# EAGLE design Temperature V 1.0 (EAGLE 7.6.0)
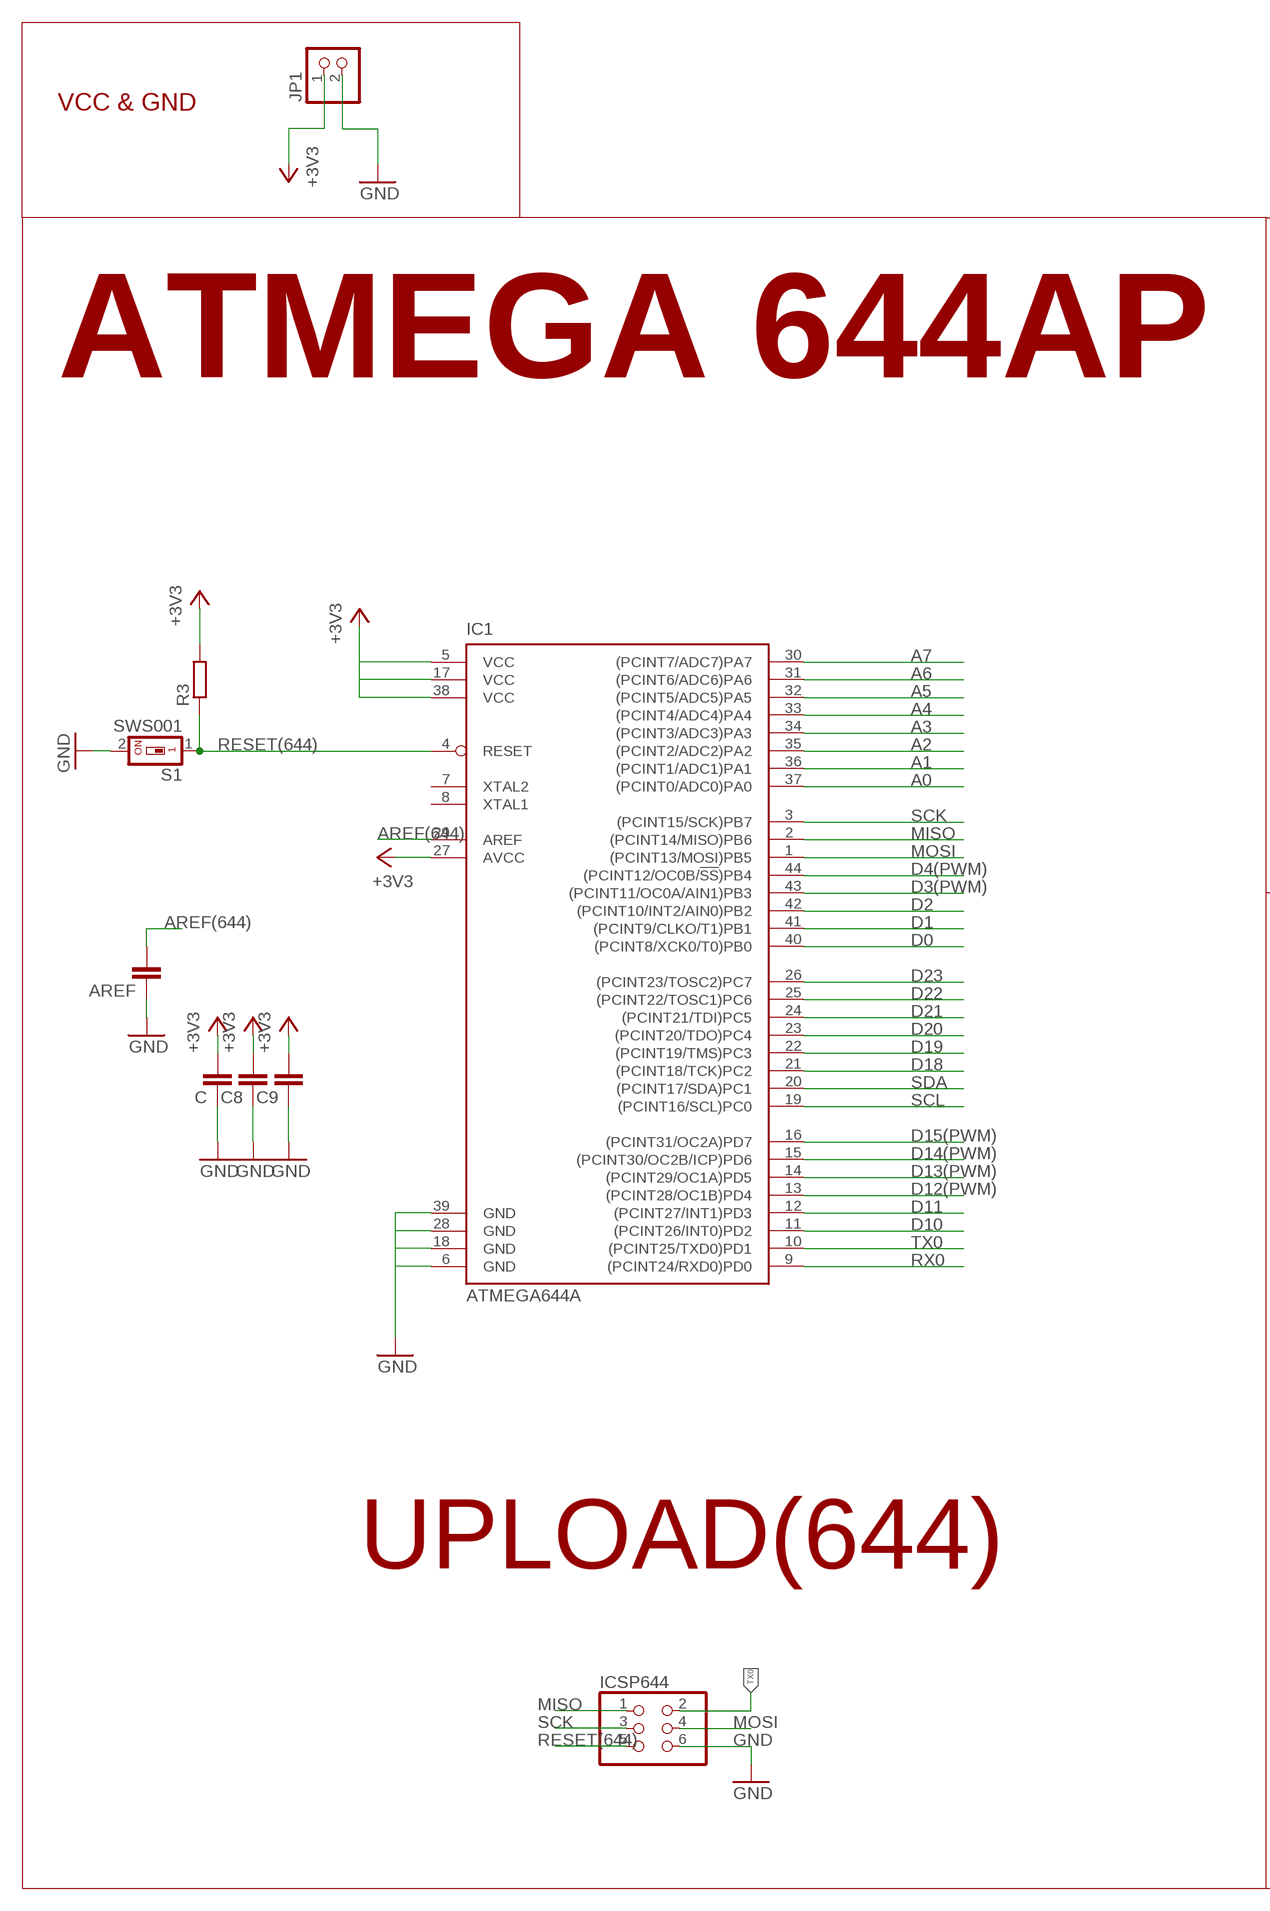
[diagram p0: schematic, sheet 1, part 1 of 2]
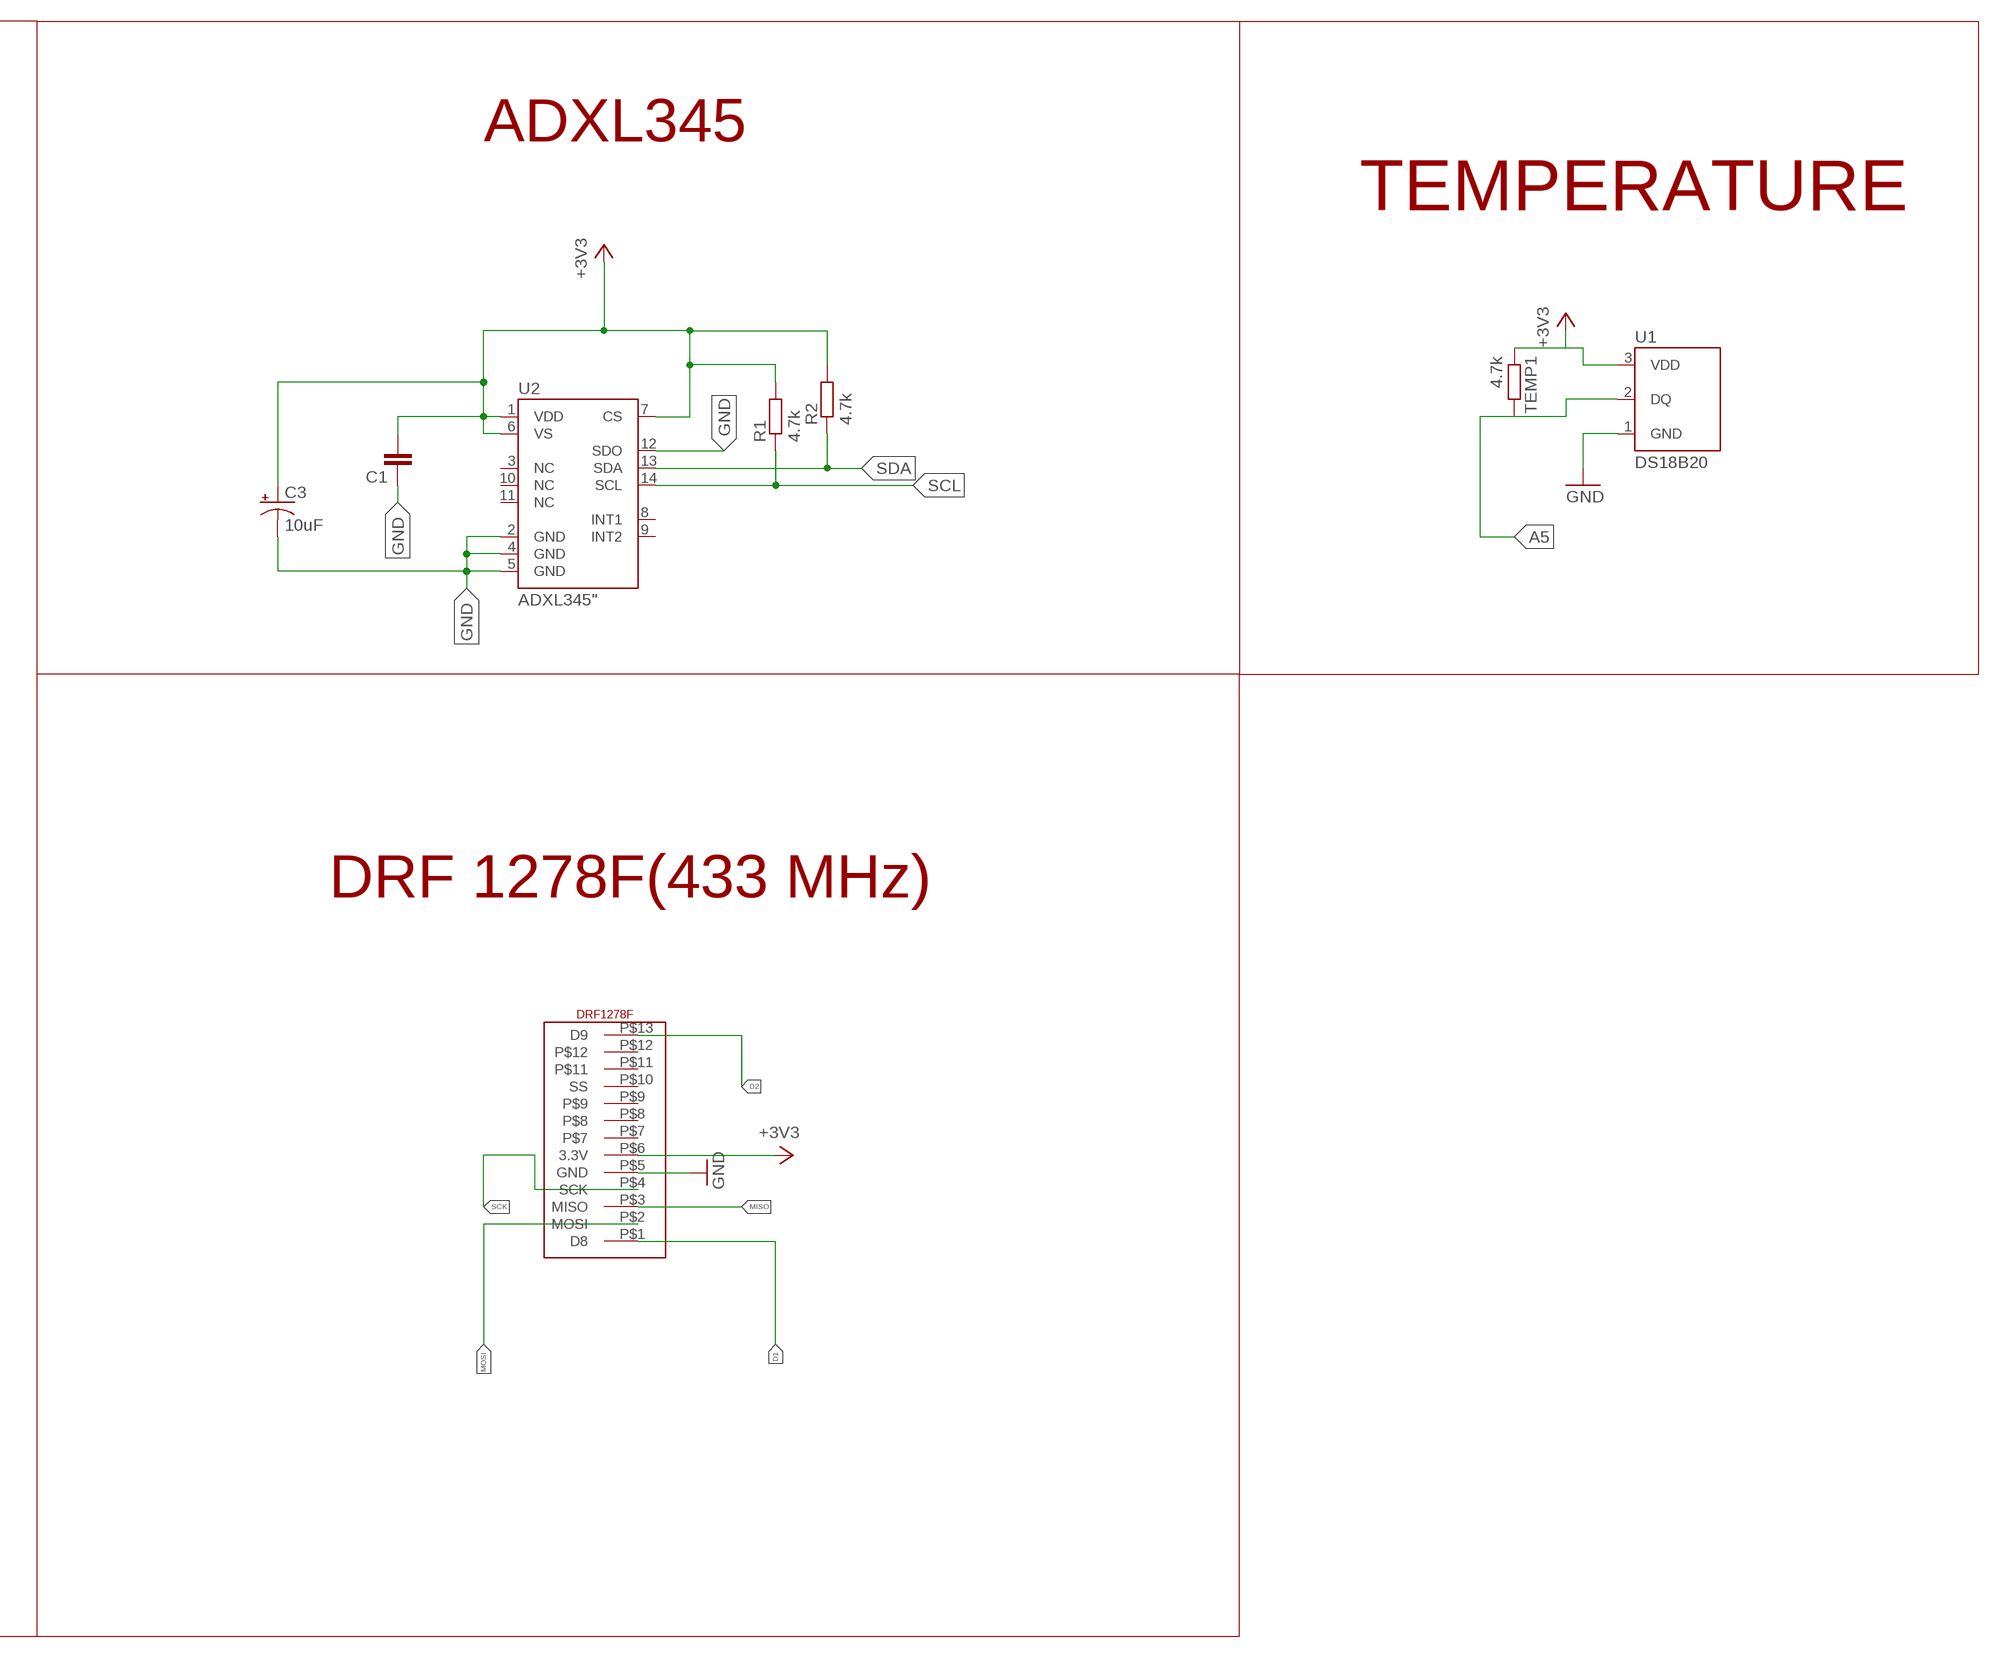
[diagram p1: schematic, sheet 1, part 2 of 2]

## Parts
AREF  100nF  C-EUC0805  [C0805]
C  22 uF  C-EUC0805  [C0805]
C1  0.1uF  C-EUC0805  [C0805]
C3  10uF  CAP_POL1206  [EIA3216]
C8  100nF  C-EUC0805  [C0805]
C9  100nF  C-EUC0805  [C0805]
IC1  ATMEGA644A  [TQFP44]
ICSP644  PINHD-2X3  [2X03]
JP1  PINHD-1X2  [1X02]
R1  4.7k  R-EU_R0805  [R0805]
R2  4.7k  R-EU_R0805  [R0805]
R3  R-EU_R0805  [R0805]
S1  SWS001  [SMS-001]
TEMP1  4.7k  R-EU_R0805  [R0805]
U1  DS18B20  [TO-92-AMMO]
U2  ADXL345"  [ADXL3451:1]
U$1  DRF1278F  [DIP13]

## Nets
+3V3: C1.2 C3.A(+) C8.2 C9.2 C.2 IC1.5(VCC) IC1.17(VCC) IC1.27(AVCC) IC1.38(VCC) JP1.1 R1.2 R2.2 R3.2 TEMP1.1 U1.3(VDD) U2.1(VDD) U2.6(VS) U2.7(CS) U$1.P$6(3.3V)
A0: IC1.37((PCINT0/ADC0)PA0)
A1: IC1.36((PCINT1/ADC1)PA1)
A2: IC1.35((PCINT2/ADC2)PA2)
A3: IC1.34((PCINT3/ADC3)PA3)
A4: IC1.33((PCINT4/ADC4)PA4)
A5: IC1.32((PCINT5/ADC5)PA5) TEMP1.2 U1.2(DQ)
A6: IC1.31((PCINT6/ADC6)PA6)
A7: IC1.30((PCINT7/ADC7)PA7)
AREF(644): AREF.2 IC1.29(AREF)
D0: IC1.40((PCINT8/XCK0/T0)PB0)
D1: IC1.41((PCINT9/CLKO/T1)PB1) U$1.P$1(D8)
D2: IC1.42((PCINT10/INT2/AIN0)PB2) U$1.P$13(D9)
D3(PWM): IC1.43((PCINT11/OC0A/AIN1)PB3)
D4(PWM): IC1.44((PCINT12/OC0B/!SS!)PB4)
D10: IC1.11((PCINT26/INT0)PD2)
D11: IC1.12((PCINT27/INT1)PD3)
D12(PWM): IC1.13((PCINT28/OC1B)PD4)
D13(PWM): IC1.14((PCINT29/OC1A)PD5)
D14(PWM): IC1.15((PCINT30/OC2B/ICP)PD6)
D15(PWM): IC1.16((PCINT31/OC2A)PD7)
D18: IC1.21((PCINT18/TCK)PC2)
D19: IC1.22((PCINT19/TMS)PC3)
D20: IC1.23((PCINT20/TDO)PC4)
D21: IC1.24((PCINT21/TDI)PC5)
D22: IC1.25((PCINT22/TOSC1)PC6)
D23: IC1.26((PCINT23/TOSC2)PC7)
GND: AREF.1 C1.1 C3.C(-) C8.1 C9.1 C.1 IC1.6(GND) IC1.18(GND) IC1.28(GND) IC1.39(GND) ICSP644.6 JP1.2 S1.2 U1.1(GND) U2.2(GND) U2.4(GND) U2.5(GND) U2.12(SDO) U$1.P$5(GND)
MISO: IC1.2((PCINT14/MISO)PB6) ICSP644.1 U$1.P$3(MISO)
MOSI: IC1.1((PCINT13/MOSI)PB5) ICSP644.4 U$1.P$2(MOSI)
RESET(644): IC1.4(RESET) ICSP644.5 R3.1 S1.1
RX0: IC1.9((PCINT24/RXD0)PD0)
SCK: IC1.3((PCINT15/SCK)PB7) ICSP644.3 U$1.P$4(SCK)
SCL: IC1.19((PCINT16/SCL)PC0) R1.1 U2.14(SCL)
SDA: IC1.20((PCINT17/SDA)PC1) R2.1 U2.13(SDA)
TX0: IC1.10((PCINT25/TXD0)PD1) ICSP644.2
Unconnected: IC1.7(XTAL2) IC1.8(XTAL1) U2.3(NC) U2.8(INT1) U2.9(INT2) U2.10(NC) U2.11(NC) U$1.P$7 U$1.P$8 U$1.P$9 U$1.P$10(SS) U$1.P$11 U$1.P$12

## Notes on the sheet
- VCC & GND
- ADXL345
- ATMEGA 644AP
- TEMPERATURE
- DRF 1278F(433 MHz)
- UPLOAD(644)

## Library data of the parts
AREF C C1 C8 C9 = rcl:C-EU: CAPACITOR, European symbol
C3 = SparkFun:CAP_POL: Capacitor Polarized These are standard SMD and PTH capacitors. Normally 10uF, 47uF, and 100uF in electrolytic and tantalum varieties. Always verify the external diameter of the through hole cap, it varies with capacity, voltage, and manufacturer. The EIA devices should be standard.
IC1 = atmel:ATMEGA644: 8-bit Microcontroller with 64K Bytes In-System Programmable Flash Source: http://www.atmel.com/dyn/resources/prod_documents/doc2593.pdf; MPN: ATMEGA644PV-10AU; OC_FARNELL: 1455123; OC_NEWARK: 58M3748
ICSP644 = pinhead:PINHD-2X3: PIN HEADER
JP1 = pinhead:PINHD-1X2: PIN HEADER
R1-R3 TEMP1 = resistor:R-EU_: RESISTOR, European symbol
S1 = smd-special:SWS001: SMD Dip Switch 1 pol.
U1 = SparkFun-Sensors:DS18B20: Dallas/Maxim DS18B20 1-wire temperature sensor Datasheet: http://datasheets.maximintegrated.com/en/ds/DS18B20.pdf temp thermometer 1-wire one-wire one wire; STORE_ID: SEN-00245
U2 = SparkFun-Sensors:ADXL345: 3-axis SPI/I2C 2/4/8/16g accelerometer; PROD_ID: IC-09097
U$1 = small_header:DRF1278F

## Board
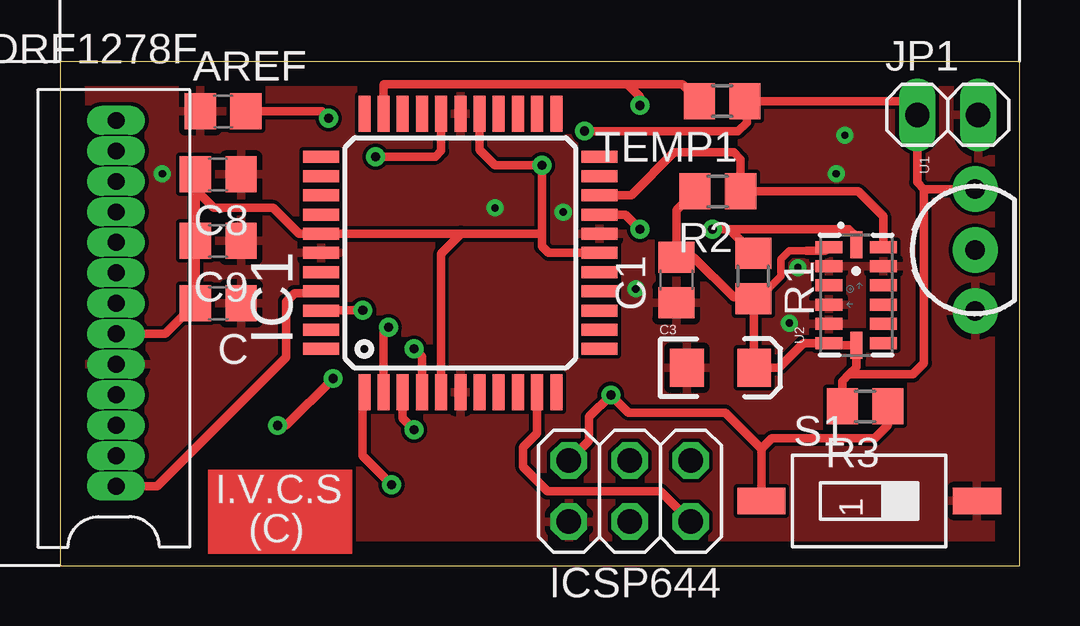
[diagram p2: board, top side]
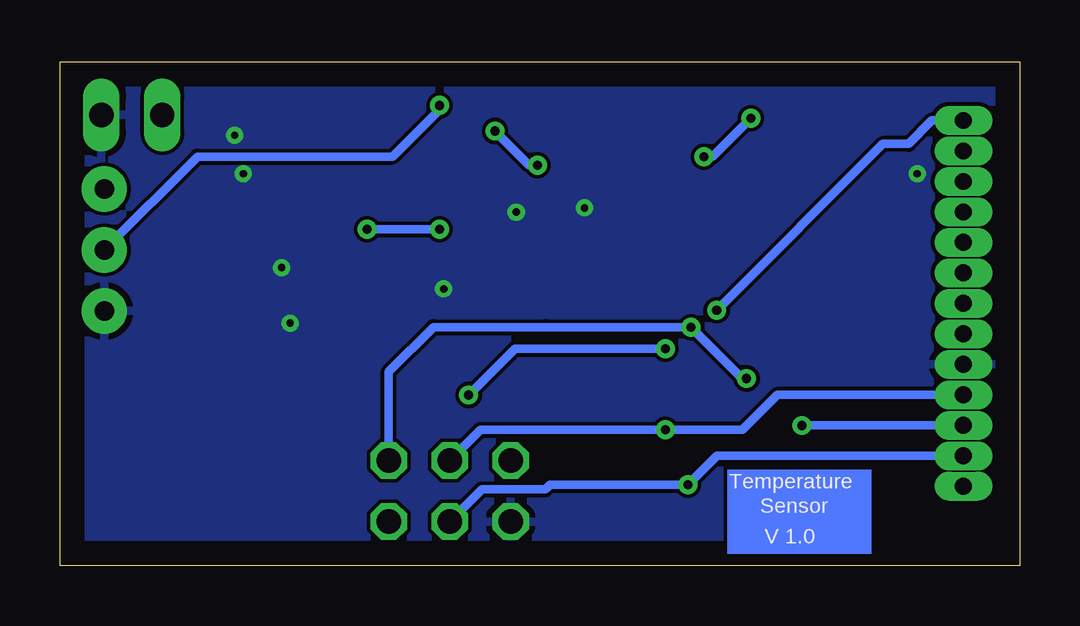
[diagram p3: board, bottom side, seen from below]

Size 40 x 21 mm. Coordinates in mm from the lower left corner, seen from the top.
Outline: 0,0 40,0 40,21 0,21 0,0
Copper layers (1*16): Top 0.035mm / dielectric 1.5mm / Bottom 0.035mm
Design rules "default *": minimum track width 9mil, minimum drill 11mil, track to track 6mil, track to pad 6mil, pad to pad 6mil, via to via 6mil, smd to smd 6mil, copper to edge 40mil, drill to drill 8mil, minimum pad ring 10mil, minimum via ring 8mil, stop-mask expansion 4mil, vias tented up to drill 0mil, thermal gap 10mil

### Footprints (pad centres in the part's own frame; a part is rotated, then mirrored left to right if it is on the bottom)
C0805 = smd 1.3 x 1.5: 1 -0.95,0; 2 0.95,0
EIA3216 = smd 1.4 x 1.6: A 1.4,0; C -1.4,0
TQFP44 = smd 1.5 x 0.5: 1 -5.8,4; 2 -5.8,3.2; 3 -5.8,2.4; 4 -5.8,1.6; 5 -5.8,0.8; 6 -5.8,0; 7 -5.8,-0.8; 8 -5.8,-1.6; 9 -5.8,-2.4; 10 -5.8,-3.2; 11 -5.8,-4; 23 5.8,-4; 24 5.8,-3.2; 25 5.8,-2.4; 26 5.8,-1.6; 27 5.8,-0.8; 28 5.8,0; 29 5.8,0.8; 30 5.8,1.6; 31 5.8,2.4; 32 5.8,3.2; 33 5.8,4 | smd 0.5 x 1.5: 12 -4,-5.8; 13 -3.2,-5.8; 14 -2.4,-5.8; 15 -1.6,-5.8; 16 -0.8,-5.8; 17 0,-5.8; 18 0.8,-5.8; 19 1.6,-5.8; 20 2.4,-5.8; 21 3.2,-5.8; 22 4,-5.8; 34 4,5.8; 35 3.2,5.8; 36 2.4,5.8; 37 1.6,5.8; 38 0.8,5.8; 39 0,5.8; 40 -0.8,5.8; 41 -1.6,5.8; 42 -2.4,5.8; 43 -3.2,5.8; 44 -4,5.8
2X03 = drill 1.016 octagon: 1 -2.54,-1.27; 2 -2.54,1.27; 3 0,-1.27; 4 0,1.27; 5 2.54,-1.27; 6 2.54,1.27
1X02 = drill 1.016 long: 1 -1.27,0; 2 1.27,0
R0805 = smd 1.3 x 1.5: 1 -0.95,0; 2 0.95,0
SMS-001 = smd 1.092 x 2.007: 1 0,-4.496; 2 0,4.496
TO-92-AMMO = drill 0.813 pad 1.88: 1 -2.54,0; 2 0,0; 3 2.54,0
ADXL3451:1 = smd 0.5 x 1.124: 1 2,1.138; 2 1.2,1.138; 3 0.4,1.138; 4 -0.4,1.138; 5 -1.2,1.138; 6 -2,1.138; 8 -2,-1.13; 9 -1.2,-1.138; 10 -0.4,-1.138; 11 0.4,-1.138; 12 1.2,-1.138; 13 2,-1.138 | smd 1.124 x 0.5: 7 -2.1,0; 14 2.1,0
DIP13 = drill 0.7 long: P$1 -2,0; P$2 -2,-1.27; P$3 -2,-2.54; P$4 -2,-3.81; P$5 -2,-5.08; P$6 -2,-6.35; P$7 -2,-7.62; P$8 -2,-8.89; P$9 -2,-10.16; P$10 -2,-11.43; P$11 -2,-12.7; P$12 -2,-13.97; P$13 -2,-15.24

### Placement (x,y rotation side)
AREF  6.8,18.92 0 top
C  6.6,10.93 180 top
C1  25.69,11.9 90 top
C3  27.53,8.24 0 top
C8  6.6,16.3 180 top
C9  6.6,13.52 180 top
IC1  16.69,13.02 90 top
ICSP644  23.76,3.1 180 top
JP1  37.01,18.78 0 top
R1  28.9,12.07 270 top
R2  27.42,15.58 180 top
R3  33.56,6.63 180 top
S1  33.73,2.69 270 top
TEMP1  27.6,19.35 180 top
U1  38.15,13.15 90 top
U2  33.19,11.27 90 top
U$1  0.34,3.3 180 top

### Tracks (layer width: path | path; a pad name or v marks a point on that pad's centre or on a via)
+3V3  (via drill 0.38)
  Top 0.305: R1.2 29.11,11.12 30.05,12.06 30.05,12.77 30.4,13.12 31.11,13.12
  Top 0.356: 36.02,15.69 35.74,15.97 JP1.1 35.16,19.35 TEMP1.1 28.63,19.28 28.63,18.46 28.27,18.1 v21.87,18.1 | 36.02,15.69 U1.3 | IC1.27 17.49,17.33 18.14,16.68 v20.09,16.68 20.09,13.84 | 20.09,13.84 20.09,13.3 20.37,13.02 IC1.17 | 16.71,13.82 IC1.38 9.97,13.82 8.89,14.9 6.4,14.9 5.65,15.65 C8.2 C9.2 C.2 4.38,9.65 U$1.P$6 | 16.71,13.82 20.08,13.82 20.09,13.84 | IC1.5 15.89,13 16.71,13.82 | R3.2 32.61,7.68 32.89,7.97 | 32.89,7.97 35.56,7.97 36.02,8.43 36.02,15.69 | R2.2 25.69,14.8 C1.2 26.41,12.85 28.09,11.17 28.84,11.17 R1.2 28.93,11.08 C3.A 29.97,8.24 30.99,9.27 U2.6 32.15,9.17 U2.7 33.19,8.26 32.89,7.97 | 31.11,13.12 31.9,13.12 U2.1
  Bottom 0.356: v20.09,16.68 20.45,16.68 v21.87,18.1
A5  (via drill 0.38)
  Top 0.356: TEMP1.2 25.94,20.06 23.65,20.06 | 23.65,20.06 13.51,20.06 13.49,20.03 IC1.32 | v24.18,19.17 24.18,19.52 23.65,20.06
  Bottom 0.356: U1.2 34.26,17.04 26.14,17.04 24.18,18.99 v24.18,19.17
AREF(644)  (via drill 0.38)
  Top 0.356: AREF.2 10.92,18.92 v11.2,18.64 | v13.16,17.04 15.65,17.04 15.89,17.28 IC1.29
  Bottom 0.356: v11.2,18.64 12.8,17.04 v13.16,17.04
D1
  Top 0.356: U$1.P$1 4.05,3.3 9.42,8.68 9.42,10.99 9.78,11.35 10.81,11.35 IC1.41
D2  (via drill 0.38)
  Top 0.356: v12.62,10.63 10.9,10.63 IC1.42
  Bottom 0.356: U$1.P$13 3.65,18.54 4.62,17.57 5.69,17.57 v12.62,10.63
GND  (via drill 0.3)
  other vias: 32.72,17.92 18.14,14.9 32.36,16.32 30.4,10.1 24,11.52 20.98,14.72 30.76,12.41 4.27,16.32
  pour Top: 0.53,21.06 0.03,-0.14 40.15,0.36 40.15,21.06
  pour Bottom: 0.18,21.06 39.83,21.06 39.83,0.18 0.18,0.18
MISO  (via drill 0.38)
  Top 0.356: v9.07,5.83 9.42,5.83 v11.38,7.79 | v13.69,9.92 13.49,9.72 IC1.2
  Bottom 0.356: U$1.P$3 9.06,5.84 v9.07,5.83 | v11.38,7.79 11.56,7.79 v13.69,9.92 19.74,9.92 19.74,9.93 24.43,9.93 26.3,8.07 ICSP644.1
MOSI  (via drill 0.38)
  Top 0.356: IC1.1 12.62,7.16 12.62,4.57 v13.82,3.37
  Bottom 0.356: ICSP644.4 22.41,3.17 19.76,3.17 19.57,3.37 v13.82,3.37 12.62,4.57 U$1.P$2
RESET(644)  (via drill 0.38)
  Top 0.356: S1.1 29.24,4.87 | 29.24,4.87 27.74,6.37 23.7,6.37 v22.96,7.1 22.05,6.19 22.05,5.2 ICSP644.5 | 15.11,7.25 IC1.4 15.09,8.7 v14.76,9.03 | R3.1 34.51,5.85 33.96,5.3 29.67,5.3 29.24,4.87
  Bottom 0.356: v14.76,9.03 21.03,9.03 v22.96,7.1
SCK  (via drill 0.38)
  Top 0.356: v14.76,5.66 14.29,6.12 IC1.3
  Bottom 0.356: U$1.P$4 10.1,7.11 11.56,5.66 v14.76,5.66 22.47,5.66 ICSP644.3
SCL  (via drill 0.38)
  Top 0.356: R1.1 27.9,14.01 | 27.9,14.01 v27.2,14.01 | v24.18,14.01 23.57,14.62 IC1.19 | U2.14 33.19,13.72 32.89,14.01 27.9,14.01
  Bottom 0.356: v27.2,14.01 v24.18,14.01
SDA
  Top 0.356: U2.13 34.31,13.28 34.31,14.55 33.28,15.58 R2.1 28.37,16.93 28.09,17.21 25.6,17.21 23.81,15.42 IC1.20
TX0
  Top 0.356: ICSP644.2 25.04,3.09 20.32,3.09 19.3,4.11 19.3,4.92 19.89,5.5 IC1.10
(copper drawn outside any net)
  shapes: Bottom area x1, Top area x1

### Text on the board
tPlace: I.V.C.S | (C)
bPlace: Temperature | Sensor | V 1.0